# EAGLE design Solar 5 cell V4_fixed_footprint (EAGLE 7.6.0)
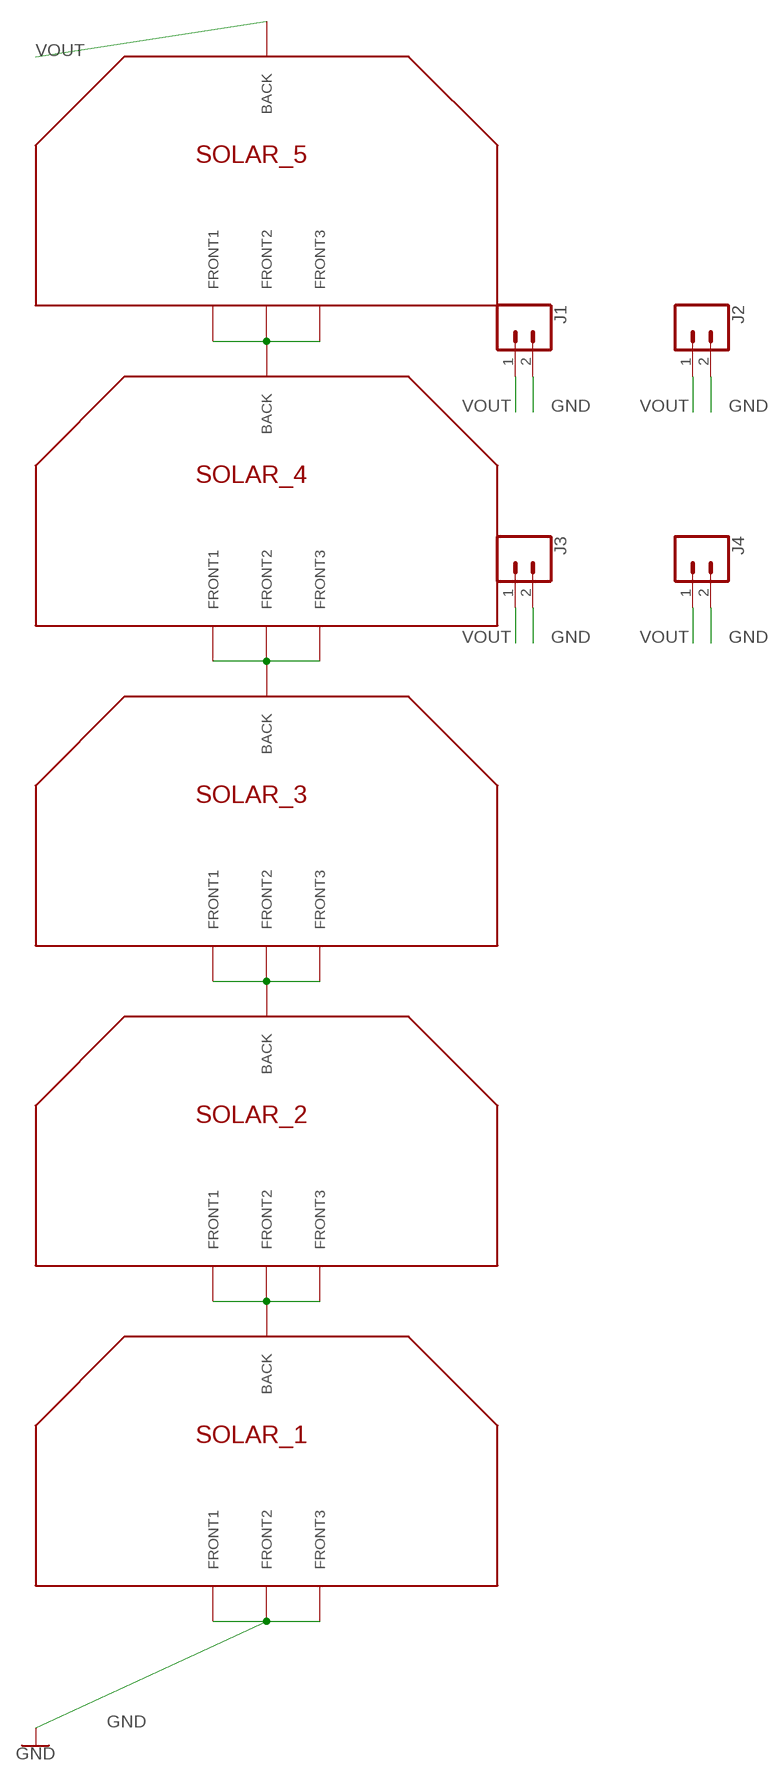
[diagram p0: schematic, sheet 1]

## Parts
J1  CONN_02  [1X02]
J2  CONN_02  [1X02]
J3  CONN_02  [1X02]
J4  CONN_02  [1X02]
SOLAR_1  SOLAR_CELL_HALF_TABSFULL_TABS  [SOLAR_CELL_3G30A_FULL_TABS]
SOLAR_2  SOLAR_CELL_HALF_TABSFULL_TABS  [SOLAR_CELL_3G30A_FULL_TABS]
SOLAR_3  SOLAR_CELL_HALF_TABSFULL_TABS  [SOLAR_CELL_3G30A_FULL_TABS]
SOLAR_4  SOLAR_CELL_HALF_TABSFULL_TABS  [SOLAR_CELL_3G30A_FULL_TABS]
SOLAR_5  SOLAR_CELL_HALF_TABSFULL_TABS  [SOLAR_CELL_3G30A_FULL_TABS]

## Nets
1-2 [PANEL]: SOLAR_1.P$1(BACK) SOLAR_2.P$F1(FRONT1) SOLAR_2.P$F2(FRONT2) SOLAR_2.P$F3(FRONT3)
2-3 [PANEL]: SOLAR_2.P$1(BACK) SOLAR_3.P$F1(FRONT1) SOLAR_3.P$F2(FRONT2) SOLAR_3.P$F3(FRONT3)
3-4 [PANEL]: SOLAR_3.P$1(BACK) SOLAR_4.P$F1(FRONT1) SOLAR_4.P$F2(FRONT2) SOLAR_4.P$F3(FRONT3)
4-5 [PANEL]: SOLAR_4.P$1(BACK) SOLAR_5.P$F1(FRONT1) SOLAR_5.P$F2(FRONT2) SOLAR_5.P$F3(FRONT3)
GND [PANEL]: J1.2 J2.2 J3.2 J4.2 SOLAR_1.P$F1(FRONT1) SOLAR_1.P$F2(FRONT2) SOLAR_1.P$F3(FRONT3)
VOUT [PANEL]: J1.1 J2.1 J3.1 J4.1 SOLAR_5.P$1(BACK)

## Library data of the parts
J1-J4 = SparkFun-Connectors:CONN_02: Multi connection point. Often used as Generic Header-pin footprint for 0.1 inch spaced/style header connections On any of the 0.1 inch spaced packages, you can populate with these: Break Away Headers - Straight <https://www.sparkfun.com/products/116> (PRT-00116) Break Away Male Headers - Right Angle <https://www.sparkfun.com/products/553> (PRT-00553) Female Headers <https://www.sparkfun.com/products/115> (PRT-00115) Break Away Headers - Machine Pin <https://www.sparkfun.com/products/117> (PRT-00117) Break Away Female Headers - Swiss Machine Pin <https://www.sparkfun.com/products/743> (PRT-00743) For SCREWTERMINALS and SPRING TERMINALS visit here: Screw Terimnals on SparkFun.com <https://www.sparkfun.com/search/results?term=Screw+Terminals> (5mm/3.5mm/2.54mm spacing) This device is also useful as a general connection point to wire up your design to another part of your project. Our various solder wires solder well into these plated through hole pads. Hook-Up Wire - Assortment (Stranded, 22 AWG) <https://www.sparkfun.com/products/11375> (PRT-11375) Hook-Up Wire - Assortment (Solid Core, 22 AWG) <https://www.sparkfun.com/products/11367> (PRT-11367) View the entire wire category on our website here <https://www.sparkfun.com/categories/141> Special notes: Molex polarized connector foot print use with: PRT-08233 with associated crimp pins and housings. 2.54_SCREWTERM for use with PRT-10571. 3.5mm Screw Terminal footprints for PRT-08084 5mm Screw Terminal footprints for use with PRT-08432
SOLAR_1-SOLAR_5 = CubeSat(V2.3):SOLAR_CELL_HALF_TABS

## Net classes
1 PANEL: width 0.635 mm, drill 0.254 mm, clearance 0.381 mm

## Board
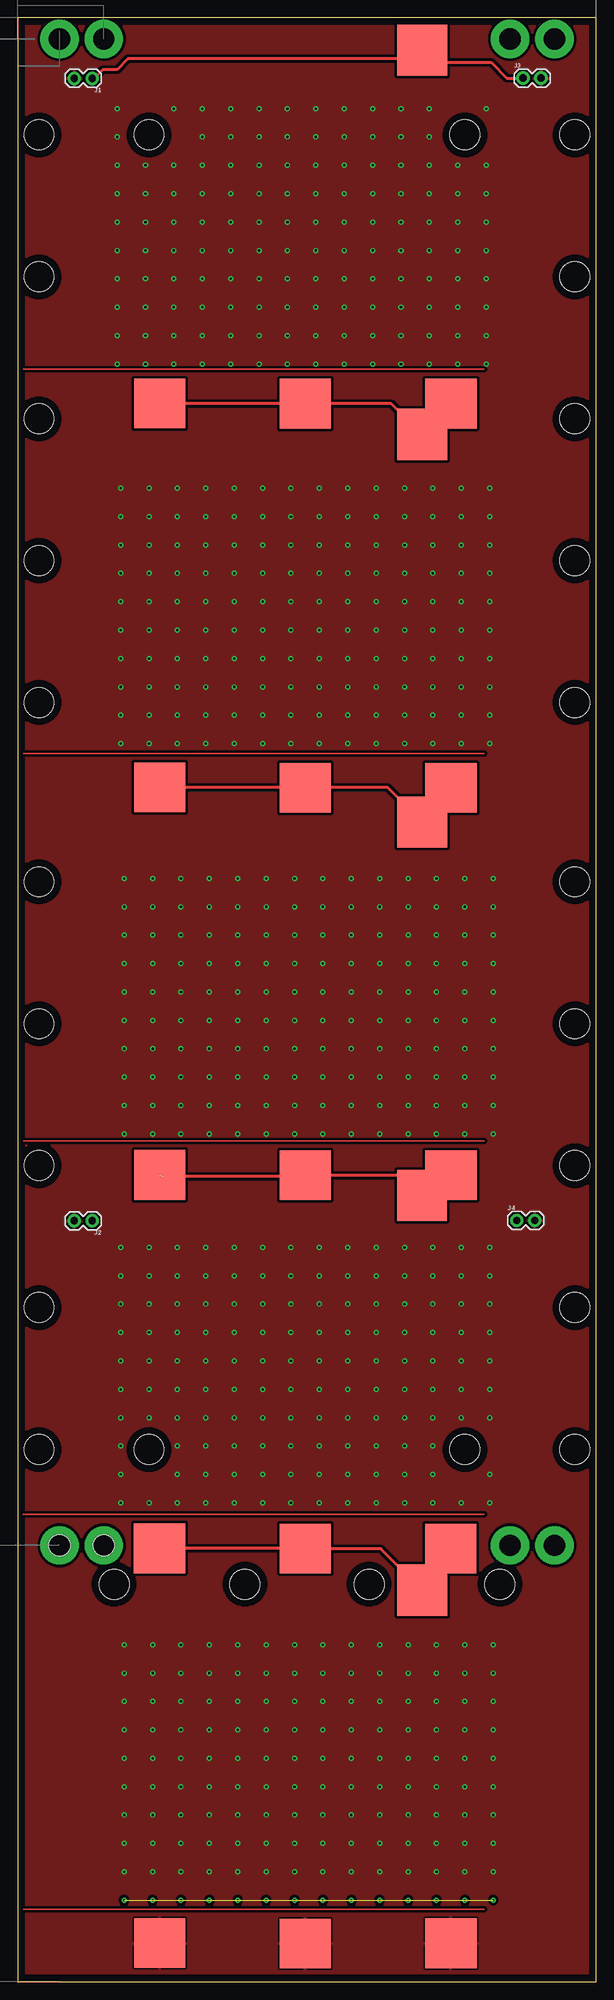
[diagram p1: board, top side]
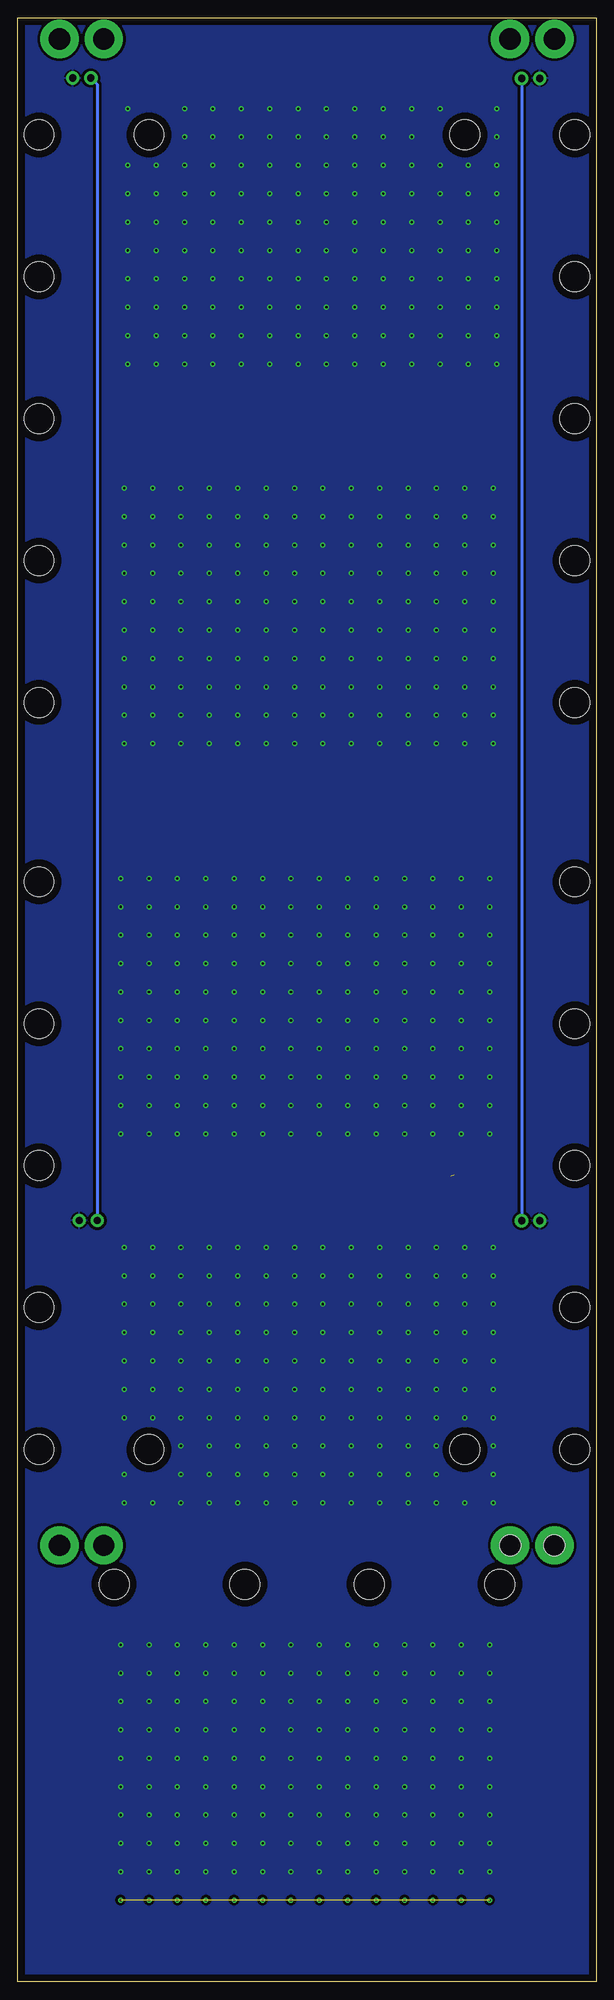
[diagram p2: board, bottom side, seen from below]

Size 81.5 x 276.8 mm. Coordinates in mm from the lower left corner, seen from the top.
Outline: 0,0 81.5,0 81.5,276.8 0,276.8 0,0
Copper layers (1*16): Top 0.035mm / dielectric 1.5mm / Bottom 0.035mm
Design rules "default": minimum track width 10mil, minimum drill 24mil, track to track 8mil, track to pad 8mil, pad to pad 8mil, via to via 8mil, smd to smd 8mil, copper to edge 40mil, drill to drill 8mil, minimum pad ring 10mil, minimum via ring 8mil, stop-mask expansion 4mil, vias tented up to drill 0mil, thermal gap 10mil
Holes 3 mm at 5.88,61.5 12.13,61.5
Holes 4.24 mm at 3,75.02 3,95.02 3,115.02 3,135.02 3,155.02 78.5,75.02 78.5,95.02 78.5,115.02 78.5,135.02 78.5,155.02 49.5,56.02 32,56.02 67.92,56.02 13.58,56.02 3,180.29 3,200.29 3,220.29 3,240.29 3,260.29 78.5,180.29 78.5,200.29 78.5,220.29 78.5,240.29 78.5,260.29 18.5,260.29 63,260.29 63,75.02 18.5,75.02

### Footprints (pad centres in the part's own frame; a part is rotated, then mirrored left to right if it is on the bottom)
1X02 = drill 1.016 pad 1.88: 1 0,0; 2 2.54,0
SOLAR_CELL_3G30A_FULL_TABS = smd 7 x 7.2: P$1 56.24,44.95 | smd 7.2 x 7: P$F1 19.24,-4.805; P$F2 39.76,-4.845; P$F3 60.29,-4.835

### Placement (x,y rotation side)
J1  10.5,268.25 180 top
J2  10.5,107.25 180 top
J3  71.2,268.3 0 top
J4  70.3,107.3 0 top
SOLAR_1  0.75,10.25 0 top
SOLAR_2  0.74,65.88 0 top
SOLAR_3  0.75,118.5 0 top
SOLAR_4  0.75,173.12 0 top
SOLAR_5  0.75,227.25 0 top

### Tracks (layer width: path | path; a pad name or v marks a point on that pad's centre or on a via)
1-2
  Top 0.406: SOLAR_2.P$F1 40.22,61.08 SOLAR_2.P$F2 51.16,61.03 SOLAR_1.P$1 61.5,59.71 61.5,62 | 61.5,62.5 61.5,62 | 61.5,62 60.79,61.29 SOLAR_2.P$F3
2-3  (1 unrouted)
  Top 0.406: SOLAR_3.P$F3 58.2,110.83 SOLAR_2.P$1 53.91,113.66 SOLAR_3.P$F2 40.35,113.5 20.5,113.5
3-4
  Top 0.406: SOLAR_4.P$F3 57,164.25 57,164 56.99,163.99 SOLAR_3.P$1 52.16,168.28 SOLAR_4.P$F2 40.47,168.32 SOLAR_4.P$F1
4-5
  Top 0.406: SOLAR_5.P$F3 56.99,218.37 SOLAR_4.P$1 52.66,222.41 SOLAR_5.P$F2 40.47,222.44 SOLAR_5.P$F1
GND  (via drill 0.3)
  Top 0.254: 20,4.5 19.99,4.5 SOLAR_1.P$F1
  other vias: 14,264 22,264 26,264 30,264 34,264 38,264 42,264 46,264 50,264 54,264 54,264 54,264 58,264 66,264 14,260 26,260 30,260 34,260 38,260 42,260 46,260 50,260 54,260 54,260 54,260 58,260 14,252 18,252 22,252 26,252 30,252 34,252 38,252 42,252 46,252 50,252 54,252 54,252 54,252 58,252 62,252 62,252 62,252 62,252 66,252 14,256 18,256 22,256 26,256 30,256 34,256 38,256 42,256 46,256 50,256 54,256 54,256 54,256 58,256 62,256 62,256 62,256 62,256 66,256 14,248 18,248 22,248 26,248 30,248 34,248 38,248 42,248 46,248 50,248 54,248 54,248 54,248 58,248 62,248 62,248 62,248 62,248 66,248 14,244 18,244 22,244 26,244 30,244 34,244 38,244 42,244 46,244 50,244 54,244 54,244 54,244 58,244 62,244 62,244 62,244 62,244 66,244 14,240 18,240 22,240 26,240 30,240 34,240 38,240 42,240 46,240 50,240 54,240 54,240 54,240 58,240 62,240 62,240 62,240 62,240 66,240 14,236 18,236 22,236 26,236 30,236 34,236 38,236 42,236 46,236 50,236 54,236 54,236 54,236 58,236 62,236 62,236 62,236 62,236 66,236 14,232 18,232 22,232 26,232 30,232 34,232 38,232 42,232 46,232 50,232 54,232 54,232 54,232 58,232 62,232 62,232 62,232 62,232 66,232 14,228 18,228 22,228 26,228 30,228 34,228 38,228 42,228 46,228 50,228 54,228 54,228 54,228 58,228 62,228 62,228 62,228 62,228 66,228 14.5,210.5 18.5,210.5 22.5,210.5 26.5,210.5 30.5,210.5 34.5,210.5 38.5,210.5 42.5,210.5 46.5,210.5 50.5,210.5 54.5,210.5 54.5,210.5 54.5,210.5 58.5,210.5 62.5,210.5 62.5,210.5 62.5,210.5 62.5,210.5 66.5,210.5 14.5,206.5 18.5,206.5 22.5,206.5 26.5,206.5 30.5,206.5 34.5,206.5 38.5,206.5 42.5,206.5 46.5,206.5 50.5,206.5 54.5,206.5 54.5,206.5 54.5,206.5 58.5,206.5 62.5,206.5 62.5,206.5 62.5,206.5 62.5,206.5 66.5,206.5 14.5,202.5 18.5,202.5 22.5,202.5 26.5,202.5 30.5,202.5 34.5,202.5 38.5,202.5 42.5,202.5 46.5,202.5 50.5,202.5 54.5,202.5 54.5,202.5 54.5,202.5 58.5,202.5 62.5,202.5 62.5,202.5 62.5,202.5 62.5,202.5 66.5,202.5 14.5,198.5 18.5,198.5 22.5,198.5 26.5,198.5 30.5,198.5 34.5,198.5 38.5,198.5 42.5,198.5 46.5,198.5 50.5,198.5 54.5,198.5 54.5,198.5 54.5,198.5 58.5,198.5 62.5,198.5 62.5,198.5 62.5,198.5 62.5,198.5 66.5,198.5 14.5,194.5 18.5,194.5 22.5,194.5 26.5,194.5 30.5,194.5 34.5,194.5 38.5,194.5 42.5,194.5 46.5,194.5 50.5,194.5 54.5,194.5 54.5,194.5 54.5,194.5 58.5,194.5 62.5,194.5 62.5,194.5 62.5,194.5 62.5,194.5 66.5,194.5 14.5,190.5 18.5,190.5 22.5,190.5 26.5,190.5 30.5,190.5 34.5,190.5 38.5,190.5 42.5,190.5 46.5,190.5 50.5,190.5 54.5,190.5 54.5,190.5 54.5,190.5 58.5,190.5 62.5,190.5 62.5,190.5 62.5,190.5 62.5,190.5 66.5,190.5 14.5,186.5 18.5,186.5 22.5,186.5 26.5,186.5 30.5,186.5 34.5,186.5 38.5,186.5 42.5,186.5 46.5,186.5 50.5,186.5 54.5,186.5 54.5,186.5 54.5,186.5 58.5,186.5 62.5,186.5 62.5,186.5 62.5,186.5 62.5,186.5 66.5,186.5 14.5,182.5 18.5,182.5 22.5,182.5 26.5,182.5 30.5,182.5 34.5,182.5 38.5,182.5 42.5,182.5 46.5,182.5 50.5,182.5 54.5,182.5 54.5,182.5 54.5,182.5 58.5,182.5 62.5,182.5 62.5,182.5 62.5,182.5 62.5,182.5 66.5,182.5 14.5,178.5 18.5,178.5 22.5,178.5 26.5,178.5 30.5,178.5 34.5,178.5 38.5,178.5 42.5,178.5 46.5,178.5 50.5,178.5 54.5,178.5 54.5,178.5 54.5,178.5 58.5,178.5 62.5,178.5 62.5,178.5 62.5,178.5 62.5,178.5 66.5,178.5 14.5,174.5 18.5,174.5 22.5,174.5 26.5,174.5 30.5,174.5 34.5,174.5 38.5,174.5 42.5,174.5 46.5,174.5 50.5,174.5 54.5,174.5 54.5,174.5 54.5,174.5 58.5,174.5 62.5,174.5 62.5,174.5 62.5,174.5 62.5,174.5 66.5,174.5 15,155.5 19,155.5 23,155.5 27,155.5 31,155.5 35,155.5 39,155.5 43,155.5 47,155.5 51,155.5 55,155.5 55,155.5 55,155.5 59,155.5 63,155.5 63,155.5 63,155.5 63,155.5 67,155.5 15,151.5 19,151.5 23,151.5 27,151.5 31,151.5 35,151.5 39,151.5 43,151.5 47,151.5 51,151.5 55,151.5 55,151.5 55,151.5 59,151.5 63,151.5 63,151.5 63,151.5 63,151.5 67,151.5 15,147.5 19,147.5 23,147.5 27,147.5 31,147.5 35,147.5 39,147.5 43,147.5 47,147.5 51,147.5 55,147.5 55,147.5 55,147.5 59,147.5 63,147.5 63,147.5 63,147.5 63,147.5 67,147.5 15,143.5 19,143.5 23,143.5 27,143.5 31,143.5 35,143.5 39,143.5 43,143.5 47,143.5 51,143.5 55,143.5 55,143.5 55,143.5 59,143.5 63,143.5 63,143.5 63,143.5 63,143.5 67,143.5 15,139.5 19,139.5 23,139.5 27,139.5 31,139.5 35,139.5 39,139.5 43,139.5 47,139.5 51,139.5 55,139.5 55,139.5 55,139.5 59,139.5 63,139.5 63,139.5 63,139.5 63,139.5 67,139.5 15,135.5 19,135.5 23,135.5 27,135.5 31,135.5 35,135.5 39,135.5 43,135.5 47,135.5 51,135.5 55,135.5 55,135.5 55,135.5 59,135.5 63,135.5 63,135.5 63,135.5 63,135.5 67,135.5 15,131.5 19,131.5 23,131.5 27,131.5 31,131.5 35,131.5 39,131.5 43,131.5 47,131.5 51,131.5 55,131.5 55,131.5 55,131.5 59,131.5 63,131.5 63,131.5 63,131.5 63,131.5 67,131.5 15,127.5 19,127.5 23,127.5 27,127.5 31,127.5 35,127.5 39,127.5 43,127.5 47,127.5 51,127.5 55,127.5 55,127.5 55,127.5 59,127.5 63,127.5 63,127.5 63,127.5 63,127.5 67,127.5 15,123.5 19,123.5 23,123.5 27,123.5 31,123.5 35,123.5 39,123.5 43,123.5 47,123.5 51,123.5 55,123.5 55,123.5 55,123.5 59,123.5 63,123.5 63,123.5 63,123.5 63,123.5 67,123.5 15,119.5 19,119.5 23,119.5 27,119.5 31,119.5 35,119.5 39,119.5 43,119.5 47,119.5 51,119.5 55,119.5 55,119.5 55,119.5 59,119.5 63,119.5 63,119.5 63,119.5 63,119.5 67,119.5 14.5,103.5 18.5,103.5 22.5,103.5 26.5,103.5 30.5,103.5 34.5,103.5 38.5,103.5 42.5,103.5 46.5,103.5 50.5,103.5 54.5,103.5 54.5,103.5 54.5,103.5 58.5,103.5 62.5,103.5 62.5,103.5 62.5,103.5 62.5,103.5 66.5,103.5 14.5,99.5 18.5,99.5 22.5,99.5 26.5,99.5 30.5,99.5 34.5,99.5 38.5,99.5 42.5,99.5 46.5,99.5 50.5,99.5 54.5,99.5 54.5,99.5 54.5,99.5 58.5,99.5 62.5,99.5 62.5,99.5 62.5,99.5 62.5,99.5 66.5,99.5 14.5,95.5 18.5,95.5 22.5,95.5 26.5,95.5 30.5,95.5 34.5,95.5 38.5,95.5 42.5,95.5 46.5,95.5 50.5,95.5 54.5,95.5 54.5,95.5 54.5,95.5 58.5,95.5 62.5,95.5 62.5,95.5 62.5,95.5 62.5,95.5 66.5,95.5 14.5,91.5 18.5,91.5 22.5,91.5 26.5,91.5 30.5,91.5 34.5,91.5 38.5,91.5 42.5,91.5 46.5,91.5 50.5,91.5 54.5,91.5 54.5,91.5 54.5,91.5 58.5,91.5 62.5,91.5 62.5,91.5 62.5,91.5 62.5,91.5 66.5,91.5 14.5,87.5 18.5,87.5 22.5,87.5 26.5,87.5 30.5,87.5 34.5,87.5 38.5,87.5 42.5,87.5 46.5,87.5 50.5,87.5 54.5,87.5 54.5,87.5 54.5,87.5 58.5,87.5 62.5,87.5 62.5,87.5 62.5,87.5 62.5,87.5 66.5,87.5 14.5,83.5 18.5,83.5 22.5,83.5 26.5,83.5 30.5,83.5 34.5,83.5 38.5,83.5 42.5,83.5 46.5,83.5 50.5,83.5 54.5,83.5 54.5,83.5 54.5,83.5 58.5,83.5 62.5,83.5 62.5,83.5 62.5,83.5 62.5,83.5 66.5,83.5 14.5,79.5 18.5,79.5 22.5,79.5 26.5,79.5 30.5,79.5 34.5,79.5 38.5,79.5 42.5,79.5 46.5,79.5 50.5,79.5 54.5,79.5 54.5,79.5 54.5,79.5 58.5,79.5 62.5,79.5 62.5,79.5 62.5,79.5 62.5,79.5 66.5,79.5 14.5,75.5 22.5,75.5 26.5,75.5 30.5,75.5 34.5,75.5 38.5,75.5 42.5,75.5 46.5,75.5 50.5,75.5 54.5,75.5 54.5,75.5 54.5,75.5 58.5,75.5 14.5,71.5 22.5,71.5 26.5,71.5 30.5,71.5 34.5,71.5 38.5,71.5 42.5,71.5 46.5,71.5 50.5,71.5 54.5,71.5 54.5,71.5 54.5,71.5 58.5,71.5 66.5,71.5 14.5,67.5 18.5,67.5 22.5,67.5 26.5,67.5 30.5,67.5 34.5,67.5 38.5,67.5 42.5,67.5 46.5,67.5 50.5,67.5 54.5,67.5 54.5,67.5 54.5,67.5 58.5,67.5 62.5,67.5 62.5,67.5 62.5,67.5 62.5,67.5 66.5,67.5 15,47.5 19,47.5 23,47.5 27,47.5 31,47.5 35,47.5 39,47.5 43,47.5 47,47.5 51,47.5 55,47.5 55,47.5 55,47.5 59,47.5 63,47.5 63,47.5 63,47.5 63,47.5 67,47.5 15,43.5 19,43.5 23,43.5 27,43.5 31,43.5 35,43.5 39,43.5 43,43.5 47,43.5 51,43.5 55,43.5 55,43.5 55,43.5 59,43.5 63,43.5 63,43.5 63,43.5 63,43.5 67,43.5 15,39.5 19,39.5 23,39.5 27,39.5 31,39.5 35,39.5 39,39.5 43,39.5 47,39.5 51,39.5 55,39.5 55,39.5 55,39.5 59,39.5 63,39.5 63,39.5 63,39.5 63,39.5 67,39.5 15,35.5 19,35.5 23,35.5 27,35.5 31,35.5 35,35.5 39,35.5 43,35.5 47,35.5 51,35.5 55,35.5 55,35.5 55,35.5 59,35.5 63,35.5 63,35.5 63,35.5 63,35.5 67,35.5 15,31.5 19,31.5 23,31.5 27,31.5 31,31.5 35,31.5 39,31.5 43,31.5 47,31.5 51,31.5 55,31.5 55,31.5 55,31.5 59,31.5 63,31.5 63,31.5 63,31.5 63,31.5 67,31.5 15,27.5 19,27.5 23,27.5 27,27.5 31,27.5 35,27.5 39,27.5 43,27.5 47,27.5 51,27.5 55,27.5 55,27.5 55,27.5 59,27.5 63,27.5 63,27.5 63,27.5 63,27.5 67,27.5 15,23.5 19,23.5 23,23.5 27,23.5 31,23.5 35,23.5 39,23.5 43,23.5 47,23.5 51,23.5 55,23.5 55,23.5 55,23.5 59,23.5 63,23.5 63,23.5 63,23.5 63,23.5 67,23.5 15,19.5 19,19.5 23,19.5 27,19.5 31,19.5 35,19.5 39,19.5 43,19.5 47,19.5 51,19.5 55,19.5 55,19.5 55,19.5 59,19.5 63,19.5 63,19.5 63,19.5 63,19.5 67,19.5 15,15.5 19,15.5 23,15.5 27,15.5 31,15.5 35,15.5 39,15.5 43,15.5 47,15.5 51,15.5 55,15.5 55,15.5 55,15.5 59,15.5 63,15.5 63,15.5 63,15.5 63,15.5 67,15.5
  pour Top (isolate 0.254): 0,277 81.5,277 81.5,0 0,0 0,276
  pour Bottom: 0,277 81.5,277 81.5,0 0,0
  pour Top (isolate 0.254): 0,277 81.5,277 81.5,0 0,0 0,276
GND49  (via drill 0.3)  (13 unrouted)
  other vias: 15,11.5 19,11.5 23,11.5 27,11.5 31,11.5 35,11.5 39,11.5 43,11.5 47,11.5 51,11.5 55,11.5 55,11.5 55,11.5 59,11.5 63,11.5 63,11.5 63,11.5 63,11.5 67,11.5
N$1  (via drill 3 pad 5.4)
  other vias: 5.88,61.5
N$2  (via drill 3 pad 5.4)
  other vias: 12.13,61.5
N$3  (via drill 3 pad 5.4)
  other vias: 5.88,273.8
N$4  (via drill 3 pad 5.4)
  other vias: 12.13,273.8
N$5  (via drill 3 pad 5.4)
  other vias: 69.37,273.8
N$6  (via drill 3 pad 5.4)
  other vias: 75.62,273.8
N$7  (via drill 3 pad 5.4)
  other vias: 75.62,61.5
N$8  (via drill 3 pad 5.4)
  other vias: 69.37,61.5
VOUT
  Top 0.406: J1.1 10.75,268.25 12,269.5 14,269.5 15.5,271 55.79,271 SOLAR_5.P$1 58.69,270.5 66.7,270.5 68.9,268.3 J3.1
  Bottom 0.406: J1.1 J2.1 | J3.1 70.3,267.4 J4.1